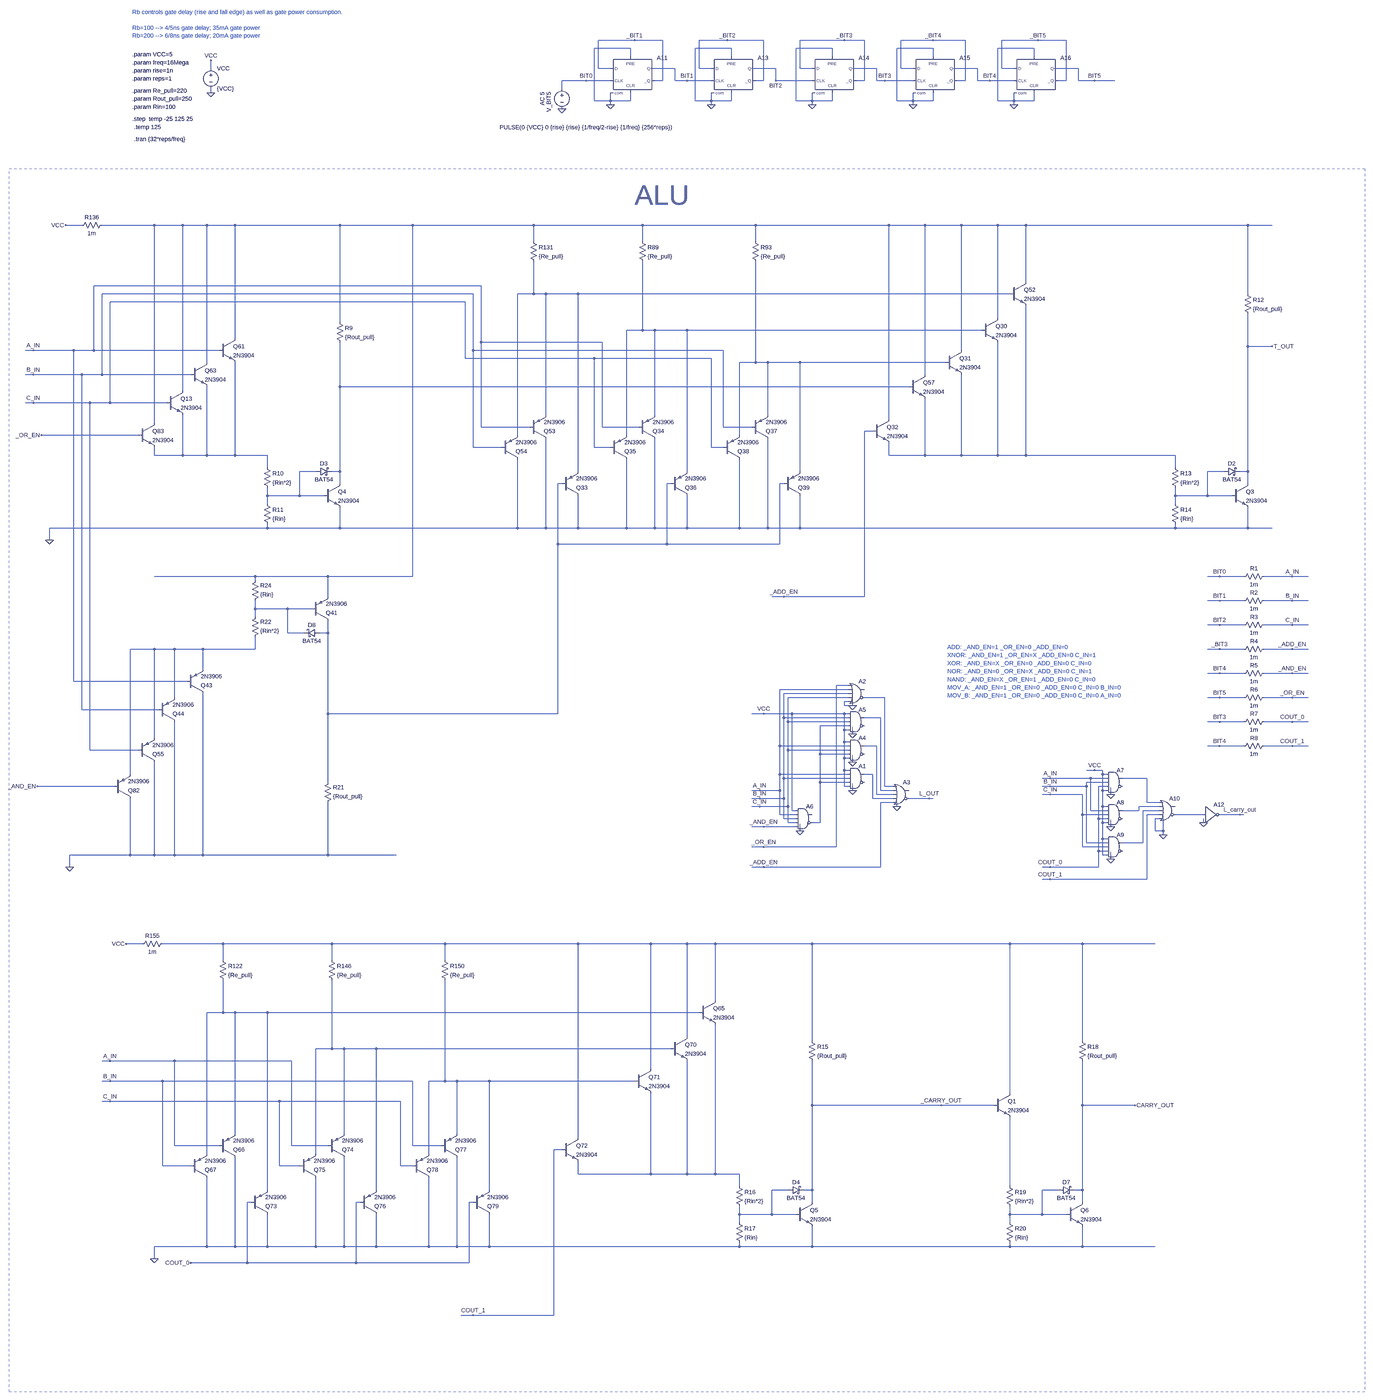
[diagram p0: schematic alu.asc, whole sheet]
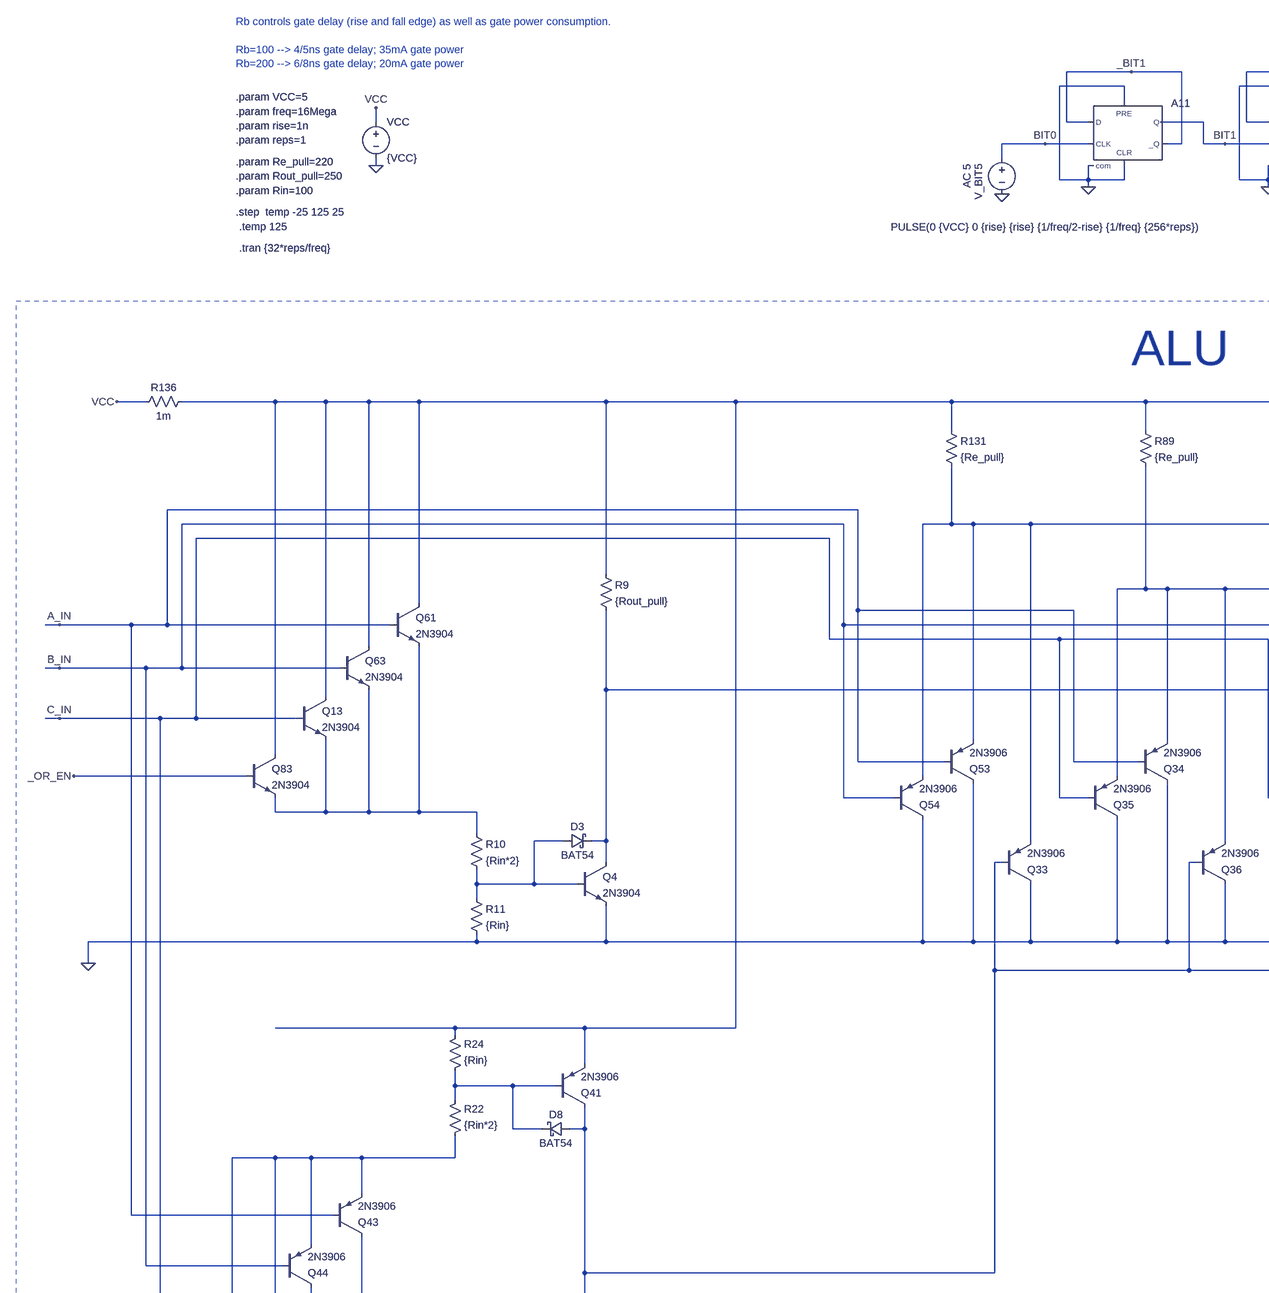
[diagram p1: schematic alu.asc, part, row 1 of 2, column 1 of 2]
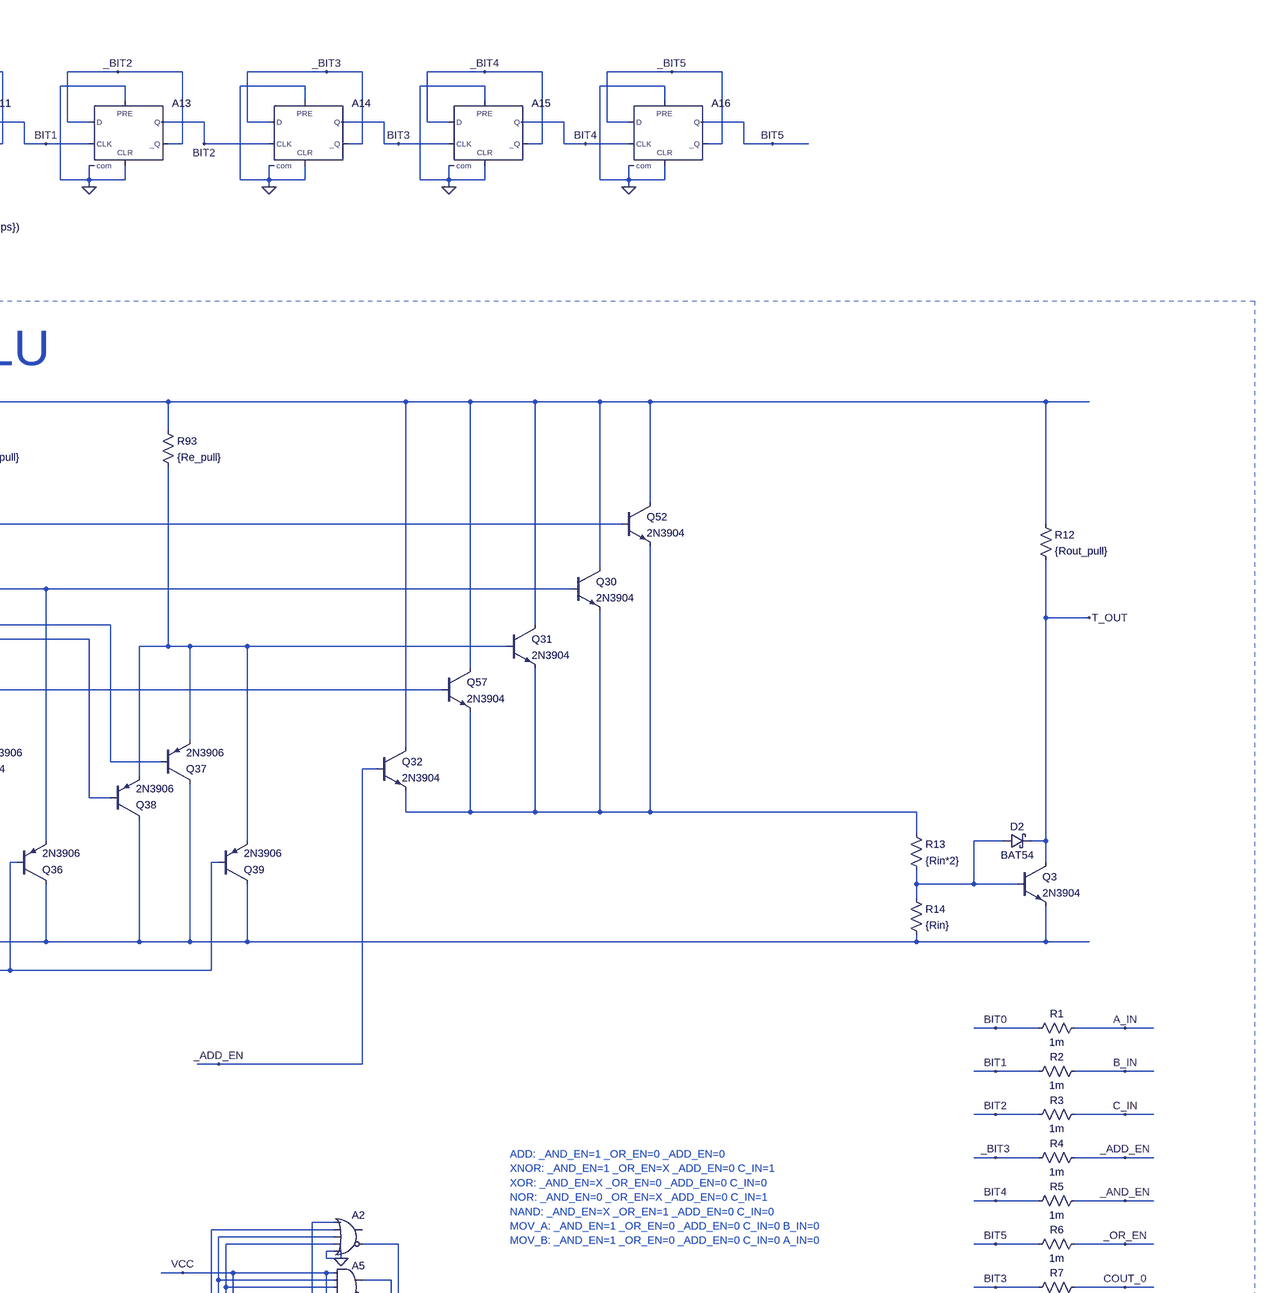
[diagram p2: schematic alu.asc, part, row 1 of 2, column 2 of 2]
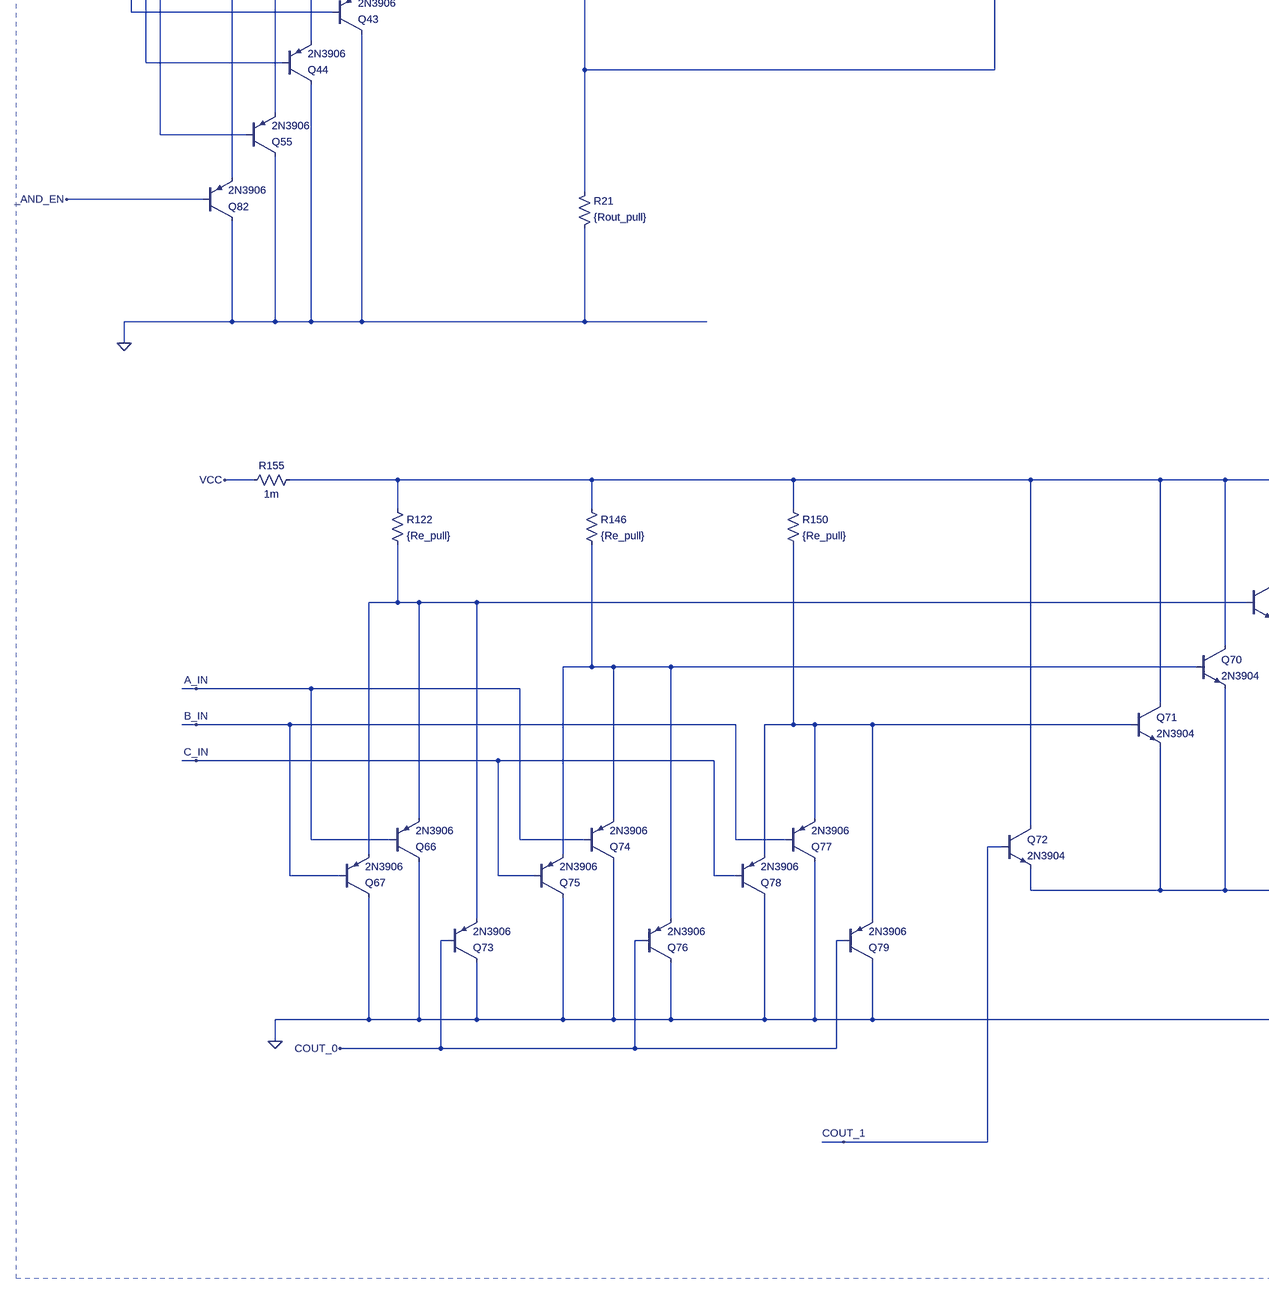
[diagram p3: schematic alu.asc, part, row 2 of 2, column 1 of 2]
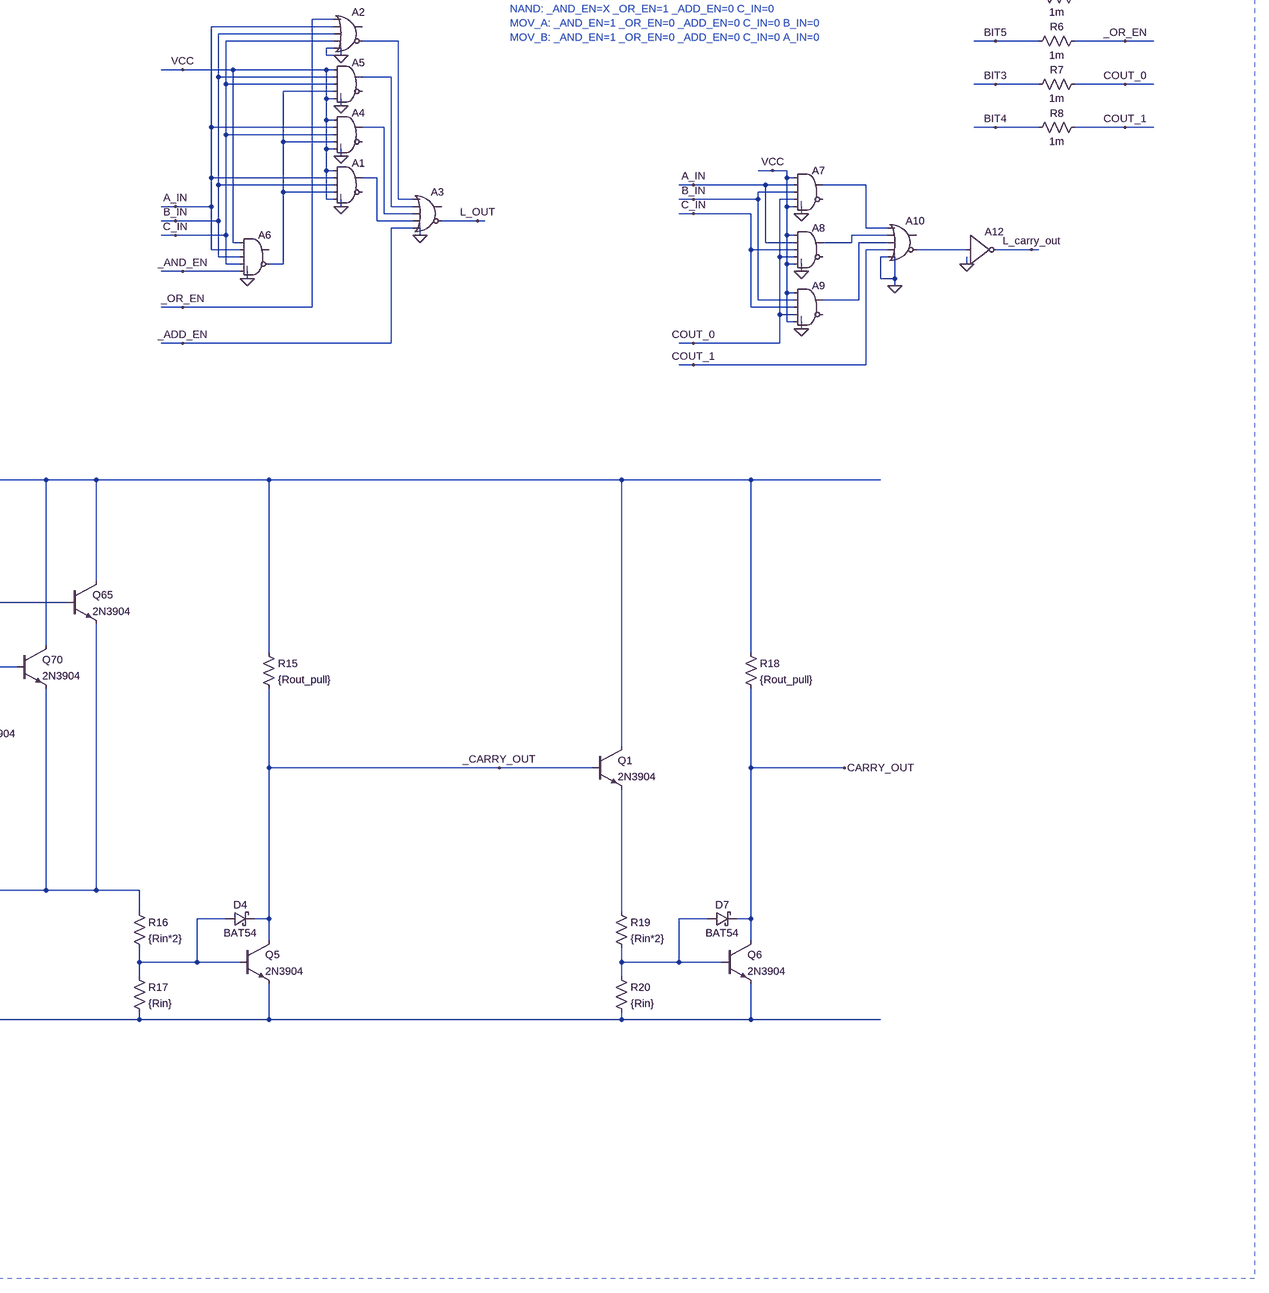
[diagram p4: schematic alu.asc, part, row 2 of 2, column 2 of 2]
alu.asc, the LTspice schematic file:
Version 4
SHEET 1 13860 8516
WIRE 5664 3040 5520 3040
WIRE 5776 3040 5664 3040
WIRE 6032 3040 5920 3040
WIRE 6176 3040 6032 3040
WIRE 6496 3040 6320 3040
WIRE 6576 3040 6496 3040
WIRE 6848 3040 6720 3040
WIRE 6976 3040 6848 3040
WIRE 7264 3040 7120 3040
WIRE 7376 3040 7264 3040
WIRE 5648 3072 5504 3072
WIRE 6048 3072 5904 3072
WIRE 6448 3072 6304 3072
WIRE 6848 3072 6704 3072
WIRE 7248 3072 7104 3072
WIRE 5648 3104 5648 3072
WIRE 6048 3104 6048 3072
WIRE 6448 3104 6448 3072
WIRE 6848 3104 6848 3072
WIRE 7248 3104 7248 3072
WIRE 3984 3152 3984 3120
WIRE 5520 3152 5520 3040
WIRE 5568 3152 5520 3152
WIRE 5824 3152 5728 3152
WIRE 5920 3152 5920 3040
WIRE 5968 3152 5920 3152
WIRE 6224 3152 6128 3152
WIRE 6320 3152 6320 3040
WIRE 6368 3152 6320 3152
WIRE 6624 3152 6528 3152
WIRE 6720 3152 6720 3040
WIRE 6768 3152 6720 3152
WIRE 7024 3152 6928 3152
WIRE 7120 3152 7120 3040
WIRE 7168 3152 7120 3152
WIRE 7424 3152 7328 3152
WIRE 5472 3200 5376 3200
WIRE 5568 3200 5472 3200
WIRE 5776 3200 5776 3040
WIRE 5776 3200 5744 3200
WIRE 5824 3200 5824 3152
WIRE 5872 3200 5824 3200
WIRE 5968 3200 5872 3200
WIRE 6176 3200 6176 3040
WIRE 6176 3200 6144 3200
WIRE 6224 3200 6224 3152
WIRE 6368 3200 6224 3200
WIRE 6576 3200 6576 3040
WIRE 6576 3200 6544 3200
WIRE 6624 3200 6624 3152
WIRE 6656 3200 6624 3200
WIRE 6768 3200 6656 3200
WIRE 6976 3200 6976 3040
WIRE 6976 3200 6944 3200
WIRE 7024 3200 7024 3152
WIRE 7072 3200 7024 3200
WIRE 7168 3200 7072 3200
WIRE 7376 3200 7376 3040
WIRE 7376 3200 7344 3200
WIRE 7424 3200 7424 3152
WIRE 7488 3200 7424 3200
WIRE 7568 3200 7488 3200
WIRE 5376 3232 5376 3200
WIRE 3984 3248 3984 3232
WIRE 5504 3280 5504 3072
WIRE 5568 3280 5568 3248
WIRE 5568 3280 5504 3280
WIRE 5648 3280 5648 3248
WIRE 5648 3280 5568 3280
WIRE 5904 3280 5904 3072
WIRE 5968 3280 5968 3248
WIRE 5968 3280 5904 3280
WIRE 6048 3280 6048 3248
WIRE 6048 3280 5968 3280
WIRE 6304 3280 6304 3072
WIRE 6368 3280 6368 3248
WIRE 6368 3280 6304 3280
WIRE 6448 3280 6448 3248
WIRE 6448 3280 6368 3280
WIRE 6704 3280 6704 3072
WIRE 6768 3280 6768 3248
WIRE 6768 3280 6704 3280
WIRE 6848 3280 6848 3248
WIRE 6848 3280 6768 3280
WIRE 7104 3280 7104 3072
WIRE 7168 3280 7168 3248
WIRE 7168 3280 7104 3280
WIRE 7248 3280 7248 3248
WIRE 7248 3280 7168 3280
WIRE 5568 3296 5568 3280
WIRE 5968 3296 5968 3280
WIRE 6368 3296 6368 3280
WIRE 6768 3296 6768 3280
WIRE 7168 3296 7168 3280
WIRE 3472 3888 3408 3888
WIRE 3760 3888 3552 3888
WIRE 3872 3888 3760 3888
WIRE 3968 3888 3872 3888
WIRE 4080 3888 3968 3888
WIRE 4496 3888 4080 3888
WIRE 4784 3888 4496 3888
WIRE 5264 3888 4784 3888
WIRE 5696 3888 5264 3888
WIRE 6144 3888 5696 3888
WIRE 6672 3888 6144 3888
WIRE 6816 3888 6672 3888
WIRE 6960 3888 6816 3888
WIRE 7104 3888 6960 3888
WIRE 7216 3888 7104 3888
WIRE 8096 3888 7216 3888
WIRE 8192 3888 8096 3888
WIRE 5264 3952 5264 3888
WIRE 5696 3952 5696 3888
WIRE 6144 3952 6144 3888
WIRE 7216 4112 7216 3888
WIRE 5056 4128 3520 4128
WIRE 5024 4160 3552 4160
WIRE 5264 4160 5264 4032
WIRE 5264 4160 5200 4160
WIRE 5312 4160 5264 4160
WIRE 5440 4160 5312 4160
WIRE 7152 4160 5440 4160
WIRE 8096 4160 8096 3888
WIRE 4992 4192 3584 4192
WIRE 7104 4256 7104 3888
WIRE 4496 4272 4496 3888
WIRE 5696 4304 5696 4032
WIRE 5696 4304 5632 4304
WIRE 5744 4304 5696 4304
WIRE 5872 4304 5744 4304
WIRE 7040 4304 5872 4304
WIRE 4080 4336 4080 3888
WIRE 5056 4352 5056 4128
WIRE 5536 4352 5056 4352
WIRE 8096 4368 8096 4240
WIRE 8192 4368 8096 4368
WIRE 3280 4384 3248 4384
WIRE 3440 4384 3280 4384
WIRE 3520 4384 3520 4128
WIRE 3520 4384 3440 4384
WIRE 4016 4384 3520 4384
WIRE 5024 4384 5024 4160
WIRE 6016 4384 5024 4384
WIRE 6960 4384 6960 3888
WIRE 4992 4416 4992 4192
WIRE 5504 4416 4992 4416
WIRE 5968 4416 5504 4416
WIRE 3968 4432 3968 3888
WIRE 6144 4432 6144 4032
WIRE 6144 4432 6080 4432
WIRE 6192 4432 6144 4432
WIRE 6320 4432 6192 4432
WIRE 6896 4432 6320 4432
WIRE 3280 4480 3248 4480
WIRE 3472 4480 3280 4480
WIRE 3552 4480 3552 4160
WIRE 3552 4480 3472 4480
WIRE 3904 4480 3552 4480
WIRE 6816 4480 6816 3888
WIRE 4496 4528 4496 4352
WIRE 6752 4528 4496 4528
WIRE 3872 4544 3872 3888
WIRE 3280 4592 3248 4592
WIRE 3504 4592 3280 4592
WIRE 3584 4592 3584 4192
WIRE 3584 4592 3504 4592
WIRE 3808 4592 3584 4592
WIRE 5312 4640 5312 4160
WIRE 5744 4640 5744 4304
WIRE 6192 4640 6192 4432
WIRE 6672 4656 6672 3888
WIRE 3760 4672 3760 3888
WIRE 5056 4688 5056 4352
WIRE 5248 4688 5056 4688
WIRE 5536 4688 5536 4352
WIRE 5680 4688 5536 4688
WIRE 6016 4688 6016 4384
WIRE 6128 4688 6016 4688
WIRE 6608 4704 6576 4704
WIRE 3696 4720 3312 4720
WIRE 5200 4720 5200 4160
WIRE 5632 4720 5632 4304
WIRE 6080 4720 6080 4432
WIRE 5024 4768 5024 4384
WIRE 5136 4768 5024 4768
WIRE 5504 4768 5504 4416
WIRE 5568 4768 5504 4768
WIRE 5968 4768 5968 4416
WIRE 6016 4768 5968 4768
WIRE 3760 4800 3760 4768
WIRE 3872 4800 3872 4640
WIRE 3872 4800 3760 4800
WIRE 3968 4800 3968 4528
WIRE 3968 4800 3872 4800
WIRE 4080 4800 4080 4432
WIRE 4080 4800 3968 4800
WIRE 4208 4800 4080 4800
WIRE 6672 4800 6672 4752
WIRE 6816 4800 6816 4576
WIRE 6816 4800 6672 4800
WIRE 6960 4800 6960 4480
WIRE 6960 4800 6816 4800
WIRE 7104 4800 7104 4352
WIRE 7104 4800 6960 4800
WIRE 7216 4800 7216 4208
WIRE 7216 4800 7104 4800
WIRE 7808 4800 7216 4800
WIRE 4208 4848 4208 4800
WIRE 7808 4848 7808 4800
WIRE 4400 4864 4336 4864
WIRE 4496 4864 4496 4528
WIRE 4496 4864 4464 4864
WIRE 5440 4864 5440 4160
WIRE 5872 4864 5872 4304
WIRE 6320 4864 6320 4432
WIRE 8000 4864 7936 4864
WIRE 8096 4864 8096 4368
WIRE 8096 4864 8064 4864
WIRE 4496 4912 4496 4864
WIRE 5376 4912 5360 4912
WIRE 5808 4912 5792 4912
WIRE 6256 4912 6240 4912
WIRE 8096 4912 8096 4864
WIRE 4208 4960 4208 4928
WIRE 4336 4960 4336 4864
WIRE 4336 4960 4208 4960
WIRE 4432 4960 4336 4960
WIRE 7808 4960 7808 4928
WIRE 7936 4960 7936 4864
WIRE 7936 4960 7808 4960
WIRE 8032 4960 7936 4960
WIRE 4208 4992 4208 4960
WIRE 7808 4992 7808 4960
WIRE 4208 5088 4208 5072
WIRE 4208 5088 3344 5088
WIRE 4496 5088 4496 5008
WIRE 4496 5088 4208 5088
WIRE 5200 5088 5200 4816
WIRE 5200 5088 4496 5088
WIRE 5312 5088 5312 4736
WIRE 5312 5088 5200 5088
WIRE 5440 5088 5440 4960
WIRE 5440 5088 5312 5088
WIRE 5632 5088 5632 4816
WIRE 5632 5088 5440 5088
WIRE 5744 5088 5744 4736
WIRE 5744 5088 5632 5088
WIRE 5872 5088 5872 4960
WIRE 5872 5088 5744 5088
WIRE 6080 5088 6080 4816
WIRE 6080 5088 5872 5088
WIRE 6192 5088 6192 4736
WIRE 6192 5088 6080 5088
WIRE 6320 5088 6320 4960
WIRE 6320 5088 6192 5088
WIRE 7808 5088 7808 5072
WIRE 7808 5088 6320 5088
WIRE 8096 5088 8096 5008
WIRE 8096 5088 7808 5088
WIRE 8192 5088 8096 5088
WIRE 3344 5136 3344 5088
WIRE 5360 5152 5360 4912
WIRE 5792 5152 5792 4912
WIRE 5792 5152 5360 5152
WIRE 6240 5152 6240 4912
WIRE 6240 5152 5792 5152
WIRE 4160 5280 3760 5280
WIRE 4448 5280 4160 5280
WIRE 4784 5280 4784 3888
WIRE 4784 5280 4448 5280
WIRE 7984 5280 7936 5280
WIRE 8080 5280 7984 5280
WIRE 8272 5280 8160 5280
WIRE 8336 5280 8272 5280
WIRE 4160 5296 4160 5280
WIRE 4448 5360 4448 5280
WIRE 6256 5360 6208 5360
WIRE 6576 5360 6576 4704
WIRE 6576 5360 6256 5360
WIRE 7984 5376 7936 5376
WIRE 8080 5376 7984 5376
WIRE 8272 5376 8160 5376
WIRE 8336 5376 8272 5376
WIRE 4160 5408 4160 5376
WIRE 4288 5408 4160 5408
WIRE 4384 5408 4288 5408
WIRE 4160 5440 4160 5408
WIRE 7984 5472 7936 5472
WIRE 8080 5472 7984 5472
WIRE 8272 5472 8160 5472
WIRE 8336 5472 8272 5472
WIRE 4288 5504 4288 5408
WIRE 4352 5504 4288 5504
WIRE 4448 5504 4448 5456
WIRE 4448 5504 4416 5504
WIRE 3760 5568 3664 5568
WIRE 3840 5568 3760 5568
WIRE 3952 5568 3840 5568
WIRE 4160 5568 4160 5520
WIRE 4160 5568 3952 5568
WIRE 7984 5568 7936 5568
WIRE 8080 5568 7984 5568
WIRE 8272 5568 8160 5568
WIRE 8336 5568 8272 5568
WIRE 3952 5648 3952 5568
WIRE 7984 5664 7936 5664
WIRE 8080 5664 7984 5664
WIRE 8272 5664 8160 5664
WIRE 8336 5664 8272 5664
WIRE 3440 5696 3440 4384
WIRE 3888 5696 3440 5696
WIRE 6512 5712 6464 5712
WIRE 6512 5728 6240 5728
WIRE 6512 5744 6256 5744
WIRE 3840 5760 3840 5568
WIRE 6512 5760 6272 5760
WIRE 6656 5760 6576 5760
WIRE 7984 5760 7936 5760
WIRE 8080 5760 7984 5760
WIRE 8272 5760 8160 5760
WIRE 8336 5760 8272 5760
WIRE 6512 5776 6496 5776
WIRE 6496 5792 6496 5776
WIRE 6528 5792 6528 5776
WIRE 6528 5792 6496 5792
WIRE 3472 5808 3472 4480
WIRE 3776 5808 3472 5808
WIRE 4448 5824 4448 5504
WIRE 5360 5824 5360 5152
WIRE 5360 5824 4448 5824
WIRE 6176 5824 6128 5824
WIRE 6288 5824 6176 5824
WIRE 6496 5824 6288 5824
WIRE 6512 5824 6496 5824
WIRE 6256 5840 6256 5744
WIRE 6512 5840 6256 5840
WIRE 6640 5840 6576 5840
WIRE 6272 5856 6272 5760
WIRE 6512 5856 6272 5856
WIRE 7984 5856 7936 5856
WIRE 8080 5856 7984 5856
WIRE 8272 5856 8160 5856
WIRE 8336 5856 8272 5856
WIRE 6512 5872 6400 5872
WIRE 6496 5888 6496 5824
WIRE 6512 5888 6496 5888
WIRE 6528 5904 6528 5888
WIRE 3760 5920 3760 5568
WIRE 6496 5936 6496 5888
WIRE 6512 5936 6496 5936
WIRE 6240 5952 6240 5728
WIRE 6512 5952 6240 5952
WIRE 6624 5952 6576 5952
WIRE 7984 5952 7936 5952
WIRE 8080 5952 7984 5952
WIRE 8272 5952 8160 5952
WIRE 8336 5952 8272 5952
WIRE 3504 5968 3504 4592
WIRE 3696 5968 3504 5968
WIRE 6272 5968 6272 5856
WIRE 6512 5968 6272 5968
WIRE 6400 5984 6400 5872
WIRE 6512 5984 6400 5984
WIRE 6496 6000 6496 5936
WIRE 6512 6000 6496 6000
WIRE 6528 6016 6528 6000
WIRE 6496 6048 6496 6000
WIRE 6512 6048 6496 6048
WIRE 7488 6048 7456 6048
WIRE 7520 6048 7488 6048
WIRE 3664 6064 3664 5568
WIRE 6240 6064 6240 5952
WIRE 6512 6064 6240 6064
WIRE 6608 6064 6576 6064
WIRE 7520 6064 7520 6048
WIRE 7536 6064 7520 6064
WIRE 6256 6080 6256 5840
WIRE 6512 6080 6256 6080
WIRE 7312 6080 7280 6080
WIRE 7472 6080 7312 6080
WIRE 7536 6080 7472 6080
WIRE 7696 6080 7600 6080
WIRE 4448 6096 4448 5824
WIRE 6400 6096 6400 5984
WIRE 6512 6096 6400 6096
WIRE 7536 6096 7456 6096
WIRE 3600 6112 3296 6112
WIRE 6496 6112 6496 6048
WIRE 6512 6112 6496 6112
WIRE 6656 6112 6656 5760
WIRE 6688 6112 6656 6112
WIRE 7312 6112 7280 6112
WIRE 7456 6112 7456 6096
WIRE 7456 6112 7312 6112
WIRE 7536 6112 7504 6112
WIRE 6160 6128 6128 6128
WIRE 6240 6128 6240 6064
WIRE 6240 6128 6160 6128
WIRE 6528 6128 6528 6112
WIRE 6640 6128 6640 5840
WIRE 6688 6128 6640 6128
WIRE 7520 6128 7520 6064
WIRE 7536 6128 7520 6128
WIRE 6624 6144 6624 5952
WIRE 6688 6144 6624 6144
WIRE 7312 6144 7280 6144
WIRE 7440 6144 7312 6144
WIRE 7552 6144 7552 6128
WIRE 6160 6160 6128 6160
WIRE 6256 6160 6256 6080
WIRE 6256 6160 6160 6160
WIRE 6608 6160 6608 6064
WIRE 6688 6160 6608 6160
WIRE 6832 6160 6752 6160
WIRE 6848 6160 6832 6160
WIRE 6688 6176 6640 6176
WIRE 7696 6176 7696 6080
WIRE 7744 6176 7696 6176
WIRE 6160 6192 6128 6192
WIRE 6272 6192 6272 5968
WIRE 6272 6192 6160 6192
WIRE 6704 6192 6704 6176
WIRE 7520 6192 7520 6128
WIRE 7536 6192 7520 6192
WIRE 7744 6192 7664 6192
WIRE 6288 6208 6288 5824
WIRE 6304 6208 6288 6208
WIRE 7472 6208 7472 6080
WIRE 7536 6208 7472 6208
WIRE 7664 6208 7664 6192
WIRE 7664 6208 7600 6208
WIRE 7744 6208 7680 6208
WIRE 6240 6224 6240 6128
WIRE 6304 6224 6240 6224
WIRE 7440 6224 7440 6144
WIRE 7536 6224 7440 6224
WIRE 7744 6224 7696 6224
WIRE 7920 6224 7808 6224
WIRE 8064 6224 7984 6224
WIRE 8080 6224 8064 6224
WIRE 6256 6240 6256 6160
WIRE 6304 6240 6256 6240
WIRE 7504 6240 7504 6112
WIRE 7536 6240 7504 6240
WIRE 7744 6240 7728 6240
WIRE 6272 6256 6272 6192
WIRE 6304 6256 6272 6256
WIRE 6400 6256 6400 6096
WIRE 6400 6256 6368 6256
WIRE 7520 6256 7520 6192
WIRE 7536 6256 7520 6256
WIRE 7920 6256 7920 6240
WIRE 6176 6272 6128 6272
WIRE 6304 6272 6176 6272
WIRE 7552 6272 7552 6256
WIRE 6320 6288 6320 6272
WIRE 7728 6288 7728 6240
WIRE 7760 6288 7760 6240
WIRE 7760 6288 7728 6288
WIRE 7760 6304 7760 6288
WIRE 7520 6320 7520 6256
WIRE 7536 6320 7520 6320
WIRE 7456 6336 7456 6112
WIRE 7536 6336 7456 6336
WIRE 7680 6336 7680 6208
WIRE 7680 6336 7600 6336
WIRE 6176 6352 6128 6352
WIRE 6464 6352 6464 5712
WIRE 6464 6352 6176 6352
WIRE 7440 6352 7440 6224
WIRE 7536 6352 7440 6352
WIRE 7504 6368 7504 6240
WIRE 7536 6368 7504 6368
WIRE 3664 6384 3664 6160
WIRE 3664 6384 3424 6384
WIRE 3760 6384 3760 6016
WIRE 3760 6384 3664 6384
WIRE 3840 6384 3840 5856
WIRE 3840 6384 3760 6384
WIRE 3952 6384 3952 5744
WIRE 3952 6384 3840 6384
WIRE 4448 6384 4448 6176
WIRE 4448 6384 3952 6384
WIRE 4720 6384 4448 6384
WIRE 7520 6384 7520 6320
WIRE 7536 6384 7520 6384
WIRE 7552 6400 7552 6384
WIRE 3424 6432 3424 6384
WIRE 6176 6432 6128 6432
WIRE 6640 6432 6640 6176
WIRE 6640 6432 6176 6432
WIRE 7312 6432 7280 6432
WIRE 7504 6432 7504 6368
WIRE 7504 6432 7312 6432
WIRE 7312 6480 7280 6480
WIRE 7696 6480 7696 6224
WIRE 7696 6480 7312 6480
WIRE 3712 6736 3648 6736
WIRE 4032 6736 3792 6736
WIRE 4464 6736 4032 6736
WIRE 4912 6736 4464 6736
WIRE 5440 6736 4912 6736
WIRE 5728 6736 5440 6736
WIRE 5872 6736 5728 6736
WIRE 5984 6736 5872 6736
WIRE 6368 6736 5984 6736
WIRE 7152 6736 6368 6736
WIRE 7440 6736 7152 6736
WIRE 7728 6736 7440 6736
WIRE 4032 6800 4032 6736
WIRE 4464 6800 4464 6736
WIRE 4912 6800 4912 6736
WIRE 5984 6960 5984 6736
WIRE 4032 7008 4032 6880
WIRE 4032 7008 3968 7008
WIRE 4080 7008 4032 7008
WIRE 4208 7008 4080 7008
WIRE 5920 7008 4208 7008
WIRE 5872 7104 5872 6736
WIRE 6368 7120 6368 6736
WIRE 7440 7120 7440 6736
WIRE 4464 7152 4464 6880
WIRE 4464 7152 4400 7152
WIRE 4512 7152 4464 7152
WIRE 4640 7152 4512 7152
WIRE 5808 7152 4640 7152
WIRE 3584 7200 3552 7200
WIRE 3840 7200 3584 7200
WIRE 4304 7200 3840 7200
WIRE 5728 7232 5728 6736
WIRE 3584 7280 3552 7280
WIRE 3792 7280 3584 7280
WIRE 4784 7280 3792 7280
WIRE 4912 7280 4912 6880
WIRE 4912 7280 4848 7280
WIRE 4960 7280 4912 7280
WIRE 5088 7280 4960 7280
WIRE 5664 7280 5088 7280
WIRE 7152 7328 7152 6736
WIRE 3584 7360 3552 7360
WIRE 4256 7360 3584 7360
WIRE 4736 7360 4256 7360
WIRE 6368 7376 6368 7200
WIRE 6880 7376 6368 7376
WIRE 7088 7376 6880 7376
WIRE 7440 7376 7440 7200
WIRE 7648 7376 7440 7376
WIRE 4080 7488 4080 7008
WIRE 4512 7488 4512 7152
WIRE 4960 7488 4960 7280
WIRE 5440 7504 5440 6736
WIRE 3840 7536 3840 7200
WIRE 4016 7536 3840 7536
WIRE 4304 7536 4304 7200
WIRE 4448 7536 4304 7536
WIRE 4784 7536 4784 7280
WIRE 4896 7536 4784 7536
WIRE 5376 7552 5344 7552
WIRE 3968 7568 3968 7008
WIRE 4400 7568 4400 7152
WIRE 4848 7568 4848 7280
WIRE 3792 7616 3792 7280
WIRE 3904 7616 3792 7616
WIRE 4256 7616 4256 7360
WIRE 4336 7616 4256 7616
WIRE 4736 7616 4736 7360
WIRE 4784 7616 4736 7616
WIRE 5440 7648 5440 7600
WIRE 5728 7648 5728 7328
WIRE 5728 7648 5440 7648
WIRE 5872 7648 5872 7200
WIRE 5872 7648 5728 7648
WIRE 5984 7648 5984 7056
WIRE 5984 7648 5872 7648
WIRE 6080 7648 5984 7648
WIRE 6080 7696 6080 7648
WIRE 7152 7696 7152 7424
WIRE 4208 7712 4208 7008
WIRE 4640 7712 4640 7152
WIRE 5088 7712 5088 7280
WIRE 6272 7712 6208 7712
WIRE 6368 7712 6368 7376
WIRE 6368 7712 6336 7712
WIRE 7344 7712 7280 7712
WIRE 7440 7712 7440 7376
WIRE 7440 7712 7408 7712
WIRE 4144 7760 4128 7760
WIRE 4576 7760 4560 7760
WIRE 5024 7760 5008 7760
WIRE 6368 7760 6368 7712
WIRE 7440 7760 7440 7712
WIRE 6080 7808 6080 7776
WIRE 6208 7808 6208 7712
WIRE 6208 7808 6080 7808
WIRE 6304 7808 6208 7808
WIRE 7152 7808 7152 7776
WIRE 7280 7808 7280 7712
WIRE 7280 7808 7152 7808
WIRE 7376 7808 7280 7808
WIRE 6080 7840 6080 7808
WIRE 7152 7840 7152 7808
WIRE 3968 7936 3968 7664
WIRE 3968 7936 3760 7936
WIRE 4080 7936 4080 7584
WIRE 4080 7936 3968 7936
WIRE 4208 7936 4208 7808
WIRE 4208 7936 4080 7936
WIRE 4400 7936 4400 7664
WIRE 4400 7936 4208 7936
WIRE 4512 7936 4512 7584
WIRE 4512 7936 4400 7936
WIRE 4640 7936 4640 7808
WIRE 4640 7936 4512 7936
WIRE 4848 7936 4848 7664
WIRE 4848 7936 4640 7936
WIRE 4960 7936 4960 7584
WIRE 4960 7936 4848 7936
WIRE 5088 7936 5088 7808
WIRE 5088 7936 4960 7936
WIRE 6080 7936 6080 7920
WIRE 6080 7936 5088 7936
WIRE 6368 7936 6368 7856
WIRE 6368 7936 6080 7936
WIRE 7152 7936 7152 7920
WIRE 7152 7936 6368 7936
WIRE 7440 7936 7440 7856
WIRE 7440 7936 7152 7936
WIRE 7728 7936 7440 7936
WIRE 3760 7984 3760 7936
WIRE 4128 8000 4128 7760
WIRE 4128 8000 3904 8000
WIRE 4560 8000 4560 7760
WIRE 4560 8000 4128 8000
WIRE 5008 8000 5008 7760
WIRE 5008 8000 4560 8000
WIRE 5024 8208 4976 8208
WIRE 5344 8208 5344 7552
WIRE 5344 8208 5024 8208
FLAG 3984 3248 0
FLAG 3984 3120 VCC
FLAG 8192 4368 T_OUT
FLAG 3344 5136 0
FLAG 3280 4384 A_IN
FLAG 3408 3888 VCC
FLAG 3280 4480 B_IN
FLAG 3280 4592 C_IN
FLAG 6256 5360 _ADD_EN
FLAG 3424 6432 0
FLAG 6880 7376 _CARRY_OUT
FLAG 5024 8208 COUT_1
FLAG 3584 7200 A_IN
FLAG 3584 7280 B_IN
FLAG 3584 7360 C_IN
FLAG 3760 7984 0
FLAG 3648 6736 VCC
FLAG 3904 8000 COUT_0
FLAG 7648 7376 CARRY_OUT
FLAG 6528 6016 0
FLAG 6528 6128 0
FLAG 6704 6192 0
FLAG 6320 6288 0
FLAG 6528 5904 0
FLAG 6528 5792 0
FLAG 7552 6400 0
FLAG 7552 6272 0
FLAG 7760 6304 0
FLAG 7920 6256 0
FLAG 7552 6144 0
FLAG 7488 6048 VCC
FLAG 6176 5824 VCC
FLAG 5568 3296 0
FLAG 5376 3312 0
FLAG 5472 3200 BIT0
FLAG 5872 3200 BIT1
FLAG 5968 3296 0
FLAG 6224 3200 BIT2
FLAG 6368 3296 0
FLAG 6496 3040 _BIT3
FLAG 6768 3296 0
FLAG 7072 3200 BIT4
FLAG 7168 3296 0
FLAG 7488 3200 BIT5
FLAG 6160 6128 A_IN
FLAG 6160 6160 B_IN
FLAG 6160 6192 C_IN
FLAG 6176 6272 _AND_EN
FLAG 6176 6352 _OR_EN
FLAG 6176 6432 _ADD_EN
FLAG 6832 6160 L_OUT
FLAG 7312 6080 A_IN
FLAG 7312 6112 B_IN
FLAG 7312 6144 C_IN
FLAG 3296 6112 _AND_EN
FLAG 3312 4720 _OR_EN
FLAG 6656 3200 BIT3
FLAG 7312 6432 COUT_0
FLAG 7312 6480 COUT_1
FLAG 8064 6224 L_carry_out
FLAG 8272 5280 A_IN
FLAG 8272 5376 B_IN
FLAG 8272 5472 C_IN
FLAG 8272 5568 _ADD_EN
FLAG 8272 5664 _AND_EN
FLAG 8272 5760 _OR_EN
FLAG 8272 5856 COUT_0
FLAG 8272 5952 COUT_1
FLAG 5664 3040 _BIT1
FLAG 6032 3040 _BIT2
FLAG 6848 3040 _BIT4
FLAG 7264 3040 _BIT5
FLAG 7984 5280 BIT0
FLAG 7984 5376 BIT1
FLAG 7984 5472 BIT2
FLAG 7984 5568 _BIT3
FLAG 7984 5664 BIT4
FLAG 7984 5760 BIT5
FLAG 7984 5856 BIT3
FLAG 7984 5952 BIT4
SYMBOL voltage 3984 3136 R0
WINDOW 123 0 0 Left 0
WINDOW 39 0 0 Left 0
SYMATTR InstName VCC
SYMATTR Value {VCC}
SYMBOL npn 7152 4112 R0
SYMATTR InstName Q52
SYMATTR Value 2N3904
SYMBOL pnp 5248 4736 M180
SYMATTR InstName Q53
SYMATTR Value 2N3906
SYMBOL pnp 5136 4816 M180
SYMATTR InstName Q54
SYMATTR Value 2N3906
SYMBOL npn 6752 4480 R0
SYMATTR InstName Q57
SYMATTR Value 2N3904
SYMBOL res 5248 3936 R0
SYMATTR InstName R131
SYMATTR Value {Re_pull}
SYMBOL res 3456 3904 R270
WINDOW 0 32 56 VTop 2
WINDOW 3 0 56 VBottom 2
SYMATTR InstName R136
SYMATTR Value 1m
SYMBOL npn 4016 4336 R0
SYMATTR InstName Q61
SYMATTR Value 2N3904
SYMBOL npn 3904 4432 R0
SYMATTR InstName Q63
SYMATTR Value 2N3904
SYMBOL npn 3808 4544 R0
SYMATTR InstName Q13
SYMATTR Value 2N3904
SYMBOL npn 7040 4256 R0
SYMATTR InstName Q30
SYMATTR Value 2N3904
SYMBOL npn 6896 4384 R0
SYMATTR InstName Q31
SYMATTR Value 2N3904
SYMBOL npn 6608 4656 R0
SYMATTR InstName Q32
SYMATTR Value 2N3904
SYMBOL pnp 5376 4960 M180
SYMATTR InstName Q33
SYMATTR Value 2N3906
SYMBOL pnp 5680 4736 M180
SYMATTR InstName Q34
SYMATTR Value 2N3906
SYMBOL pnp 5568 4816 M180
SYMATTR InstName Q35
SYMATTR Value 2N3906
SYMBOL res 5680 3936 R0
SYMATTR InstName R89
SYMATTR Value {Re_pull}
SYMBOL pnp 5808 4960 M180
SYMATTR InstName Q36
SYMATTR Value 2N3906
SYMBOL pnp 6128 4736 M180
SYMATTR InstName Q37
SYMATTR Value 2N3906
SYMBOL pnp 6016 4816 M180
SYMATTR InstName Q38
SYMATTR Value 2N3906
SYMBOL res 6128 3936 R0
SYMATTR InstName R93
SYMATTR Value {Re_pull}
SYMBOL pnp 6256 4960 M180
SYMATTR InstName Q39
SYMATTR Value 2N3906
SYMBOL pnp 4384 5456 M180
SYMATTR InstName Q41
SYMATTR Value 2N3906
SYMBOL pnp 3888 5744 M180
SYMATTR InstName Q43
SYMATTR Value 2N3906
SYMBOL pnp 3776 5856 M180
SYMATTR InstName Q44
SYMATTR Value 2N3906
SYMBOL pnp 3696 6016 M180
SYMATTR InstName Q55
SYMATTR Value 2N3906
SYMBOL npn 5920 6960 R0
SYMATTR InstName Q65
SYMATTR Value 2N3904
SYMBOL pnp 4016 7584 M180
SYMATTR InstName Q66
SYMATTR Value 2N3906
SYMBOL pnp 3904 7664 M180
SYMATTR InstName Q67
SYMATTR Value 2N3906
SYMBOL res 4016 6784 R0
SYMATTR InstName R122
SYMATTR Value {Re_pull}
SYMBOL npn 5808 7104 R0
SYMATTR InstName Q70
SYMATTR Value 2N3904
SYMBOL npn 5664 7232 R0
SYMATTR InstName Q71
SYMATTR Value 2N3904
SYMBOL npn 5376 7504 R0
SYMATTR InstName Q72
SYMATTR Value 2N3904
SYMBOL pnp 4144 7808 M180
SYMATTR InstName Q73
SYMATTR Value 2N3906
SYMBOL pnp 4448 7584 M180
SYMATTR InstName Q74
SYMATTR Value 2N3906
SYMBOL pnp 4336 7664 M180
SYMATTR InstName Q75
SYMATTR Value 2N3906
SYMBOL res 4448 6784 R0
SYMATTR InstName R146
SYMATTR Value {Re_pull}
SYMBOL pnp 4576 7808 M180
SYMATTR InstName Q76
SYMATTR Value 2N3906
SYMBOL pnp 4896 7584 M180
SYMATTR InstName Q77
SYMATTR Value 2N3906
SYMBOL pnp 4784 7664 M180
SYMATTR InstName Q78
SYMATTR Value 2N3906
SYMBOL res 4896 6784 R0
SYMATTR InstName R150
SYMATTR Value {Re_pull}
SYMBOL pnp 5024 7808 M180
SYMATTR InstName Q79
SYMATTR Value 2N3906
SYMBOL res 3696 6752 R270
WINDOW 0 32 56 VTop 2
WINDOW 3 0 56 VBottom 2
SYMATTR InstName R155
SYMATTR Value 1m
SYMBOL Digital\\and 6544 6016 R0
SYMATTR SpiceLine Vhigh={VCC}
SYMATTR InstName A1
SYMBOL Digital\\or 6720 6080 R0
SYMATTR SpiceLine Vhigh={VCC}
SYMATTR InstName A3
SYMBOL Digital\\and 6544 5904 R0
SYMATTR SpiceLine Vhigh={VCC}
SYMATTR InstName A4
SYMBOL Digital\\and 6544 5792 R0
SYMATTR SpiceLine Vhigh={VCC}
SYMATTR InstName A5
SYMBOL Digital\\or 6544 5680 R0
SYMATTR SpiceLine Vhigh={VCC}
SYMATTR InstName A2
SYMBOL Digital\\and 6336 6176 R0
SYMATTR SpiceLine Vhigh={VCC}
SYMATTR InstName A6
SYMBOL Digital\\and 7568 6032 R0
SYMATTR SpiceLine Vhigh={VCC}
SYMATTR InstName A7
SYMBOL Digital\\and 7568 6160 R0
SYMATTR SpiceLine Vhigh={VCC}
SYMATTR InstName A8
SYMBOL Digital\\and 7568 6288 R0
SYMATTR SpiceLine Vhigh={VCC}
SYMATTR InstName A9
SYMBOL Digital\\or 7776 6144 R0
SYMATTR SpiceLine Vhigh={VCC}
SYMATTR InstName A10
SYMBOL Digital\\inv 7920 6160 R0
SYMATTR SpiceLine Vhigh={VCC}
SYMATTR InstName A12
SYMBOL voltage 5376 3216 R0
WINDOW 123 -77 30 VRight 2
WINDOW 39 0 0 Left 0
WINDOW 0 -51 28 VRight 2
WINDOW 3 438 169 Right 2
SYMATTR Value2 AC 5
SYMATTR InstName V_BIT5
SYMATTR Value PULSE(0 {VCC} 0 {rise} {rise} {1/freq/2-rise} {1/freq} {256*reps})
SYMBOL Digital\\dflop 5648 3104 R0
SYMATTR SpiceLine Vhigh={VCC}
SYMATTR InstName A11
SYMBOL Digital\\dflop 6048 3104 R0
SYMATTR SpiceLine Vhigh={VCC}
SYMATTR InstName A13
SYMBOL Digital\\dflop 6848 3104 R0
SYMATTR SpiceLine Vhigh={VCC}
SYMATTR InstName A15
SYMBOL Digital\\dflop 7248 3104 R0
SYMATTR SpiceLine Vhigh={VCC}
SYMATTR InstName A16
SYMBOL Digital\\dflop 6448 3104 R0
SYMATTR SpiceLine Vhigh={VCC}
SYMATTR InstName A14
SYMBOL pnp 3600 6160 M180
SYMATTR InstName Q82
SYMATTR Value 2N3906
SYMBOL npn 3696 4672 R0
SYMATTR InstName Q83
SYMATTR Value 2N3904
SYMBOL npn 8032 4912 R0
SYMATTR InstName Q3
SYMATTR Value 2N3904
SYMBOL schottky 8000 4880 R270
WINDOW 0 32 32 VTop 2
WINDOW 3 0 32 VBottom 2
SYMATTR InstName D2
SYMATTR Value BAT54
SYMATTR Description Diode
SYMATTR Type diode
SYMBOL res 8080 4144 R0
SYMATTR InstName R12
SYMATTR Value {Rout_pull}
SYMBOL res 7792 4832 R0
SYMATTR InstName R13
SYMATTR Value {Rin*2}
SYMBOL res 7792 4976 R0
SYMATTR InstName R14
SYMATTR Value {Rin}
SYMBOL npn 4432 4912 R0
SYMATTR InstName Q4
SYMATTR Value 2N3904
SYMBOL schottky 4400 4880 R270
WINDOW 0 32 32 VTop 2
WINDOW 3 0 32 VBottom 2
SYMATTR InstName D3
SYMATTR Value BAT54
SYMATTR Description Diode
SYMATTR Type diode
SYMBOL res 4480 4256 R0
SYMATTR InstName R9
SYMATTR Value {Rout_pull}
SYMBOL res 4192 4832 R0
SYMATTR InstName R10
SYMATTR Value {Rin*2}
SYMBOL res 4192 4976 R0
SYMATTR InstName R11
SYMATTR Value {Rin}
SYMBOL npn 6304 7760 R0
SYMATTR InstName Q5
SYMATTR Value 2N3904
SYMBOL schottky 6272 7728 R270
WINDOW 0 32 32 VTop 2
WINDOW 3 0 32 VBottom 2
SYMATTR InstName D4
SYMATTR Value BAT54
SYMATTR Description Diode
SYMATTR Type diode
SYMBOL res 6352 7104 R0
SYMATTR InstName R15
SYMATTR Value {Rout_pull}
SYMBOL res 6064 7680 R0
SYMATTR InstName R16
SYMATTR Value {Rin*2}
SYMBOL res 6064 7824 R0
SYMATTR InstName R17
SYMATTR Value {Rin}
SYMBOL npn 7376 7760 R0
SYMATTR InstName Q6
SYMATTR Value 2N3904
SYMBOL schottky 7344 7728 R270
WINDOW 0 32 32 VTop 2
WINDOW 3 0 32 VBottom 2
SYMATTR InstName D7
SYMATTR Value BAT54
SYMATTR Description Diode
SYMATTR Type diode
SYMBOL res 7424 7104 R0
SYMATTR InstName R18
SYMATTR Value {Rout_pull}
SYMBOL res 7136 7680 R0
SYMATTR InstName R19
SYMATTR Value {Rin*2}
SYMBOL res 7136 7824 R0
SYMATTR InstName R20
SYMATTR Value {Rin}
SYMBOL schottky 4416 5520 M270
WINDOW 0 32 32 VTop 2
WINDOW 3 0 32 VBottom 2
SYMATTR InstName D8
SYMATTR Value BAT54
SYMATTR Description Diode
SYMATTR Type diode
SYMBOL res 4432 6192 M180
WINDOW 0 36 76 Left 2
WINDOW 3 36 40 Left 2
SYMATTR InstName R21
SYMATTR Value {Rout_pull}
SYMBOL res 4144 5536 M180
WINDOW 0 36 76 Left 2
WINDOW 3 36 40 Left 2
SYMATTR InstName R22
SYMATTR Value {Rin*2}
SYMBOL res 4144 5392 M180
WINDOW 0 36 76 Left 2
WINDOW 3 36 40 Left 2
SYMATTR InstName R24
SYMATTR Value {Rin}
SYMBOL res 8176 5264 R90
WINDOW 0 0 56 VBottom 2
WINDOW 3 32 56 VTop 2
SYMATTR InstName R1
SYMATTR Value 1m
SYMBOL res 8176 5360 R90
WINDOW 0 0 56 VBottom 2
WINDOW 3 32 56 VTop 2
SYMATTR InstName R2
SYMATTR Value 1m
SYMBOL res 8176 5456 R90
WINDOW 0 0 56 VBottom 2
WINDOW 3 32 56 VTop 2
SYMATTR InstName R3
SYMATTR Value 1m
SYMBOL res 8176 5552 R90
WINDOW 0 0 56 VBottom 2
WINDOW 3 32 56 VTop 2
SYMATTR InstName R4
SYMATTR Value 1m
SYMBOL res 8176 5648 R90
WINDOW 0 0 56 VBottom 2
WINDOW 3 32 56 VTop 2
SYMATTR InstName R5
SYMATTR Value 1m
SYMBOL res 8176 5744 R90
WINDOW 0 0 56 VBottom 2
WINDOW 3 32 56 VTop 2
SYMATTR InstName R6
SYMATTR Value 1m
SYMBOL res 8176 5840 R90
WINDOW 0 0 56 VBottom 2
WINDOW 3 32 56 VTop 2
SYMATTR InstName R7
SYMATTR Value 1m
SYMBOL res 8176 5936 R90
WINDOW 0 0 56 VBottom 2
WINDOW 3 32 56 VTop 2
SYMATTR InstName R8
SYMATTR Value 1m
SYMBOL npn 7088 7328 R0
SYMATTR InstName Q1
SYMATTR Value 2N3904
TEXT 3680 3432 Left 2 !.tran {32*reps/freq}
TEXT 3672 3096 Left 2 !.param VCC=5
TEXT 3672 3128 Left 2 !.param freq=16Mega
TEXT 3672 3160 Left 2 !.param rise=1n
TEXT 3672 3192 Left 2 !.param reps=1
TEXT 3672 3240 Left 2 !.param Re_pull=220
TEXT 3672 2928 Left 2 ;Rb controls gate delay (rise and fall edge) as well as gate power consumption.\n \nRb=100 --> 4/5ns gate delay; 35mA gate power\nRb=200 --> 6/8ns gate delay; 20mA gate power
TEXT 5664 3768 Left 7 ;ALU
TEXT 6904 5560 Left 2 ;ADD: _AND_EN=1 _OR_EN=0 _ADD_EN=0
TEXT 6904 5592 Left 2 ;XNOR: _AND_EN=1 _OR_EN=X _ADD_EN=0 C_IN=1
TEXT 6904 5624 Left 2 ;XOR: _AND_EN=X _OR_EN=0 _ADD_EN=0 C_IN=0
TEXT 6904 5656 Left 2 ;NOR: _AND_EN=0 _OR_EN=X _ADD_EN=0 C_IN=1
TEXT 6904 5688 Left 2 ;NAND: _AND_EN=X _OR_EN=1 _ADD_EN=0 C_IN=0
TEXT 6904 5720 Left 2 ;MOV_A: _AND_EN=1 _OR_EN=0 _ADD_EN=0 C_IN=0 B_IN=0
TEXT 6904 5752 Left 2 ;MOV_B: _AND_EN=1 _OR_EN=0 _ADD_EN=0 C_IN=0 A_IN=0
TEXT 3672 3272 Left 2 !.param Rout_pull=250
TEXT 3672 3304 Left 2 !.param Rin=100
TEXT 3672 3352 Left 2 !.step  temp -25 125 25
TEXT 3680 3384 Left 2 !.temp 125
RECTANGLE Normal 8560 8512 3184 3664 2

The netlist it stands for:
* alu.asc
VCC VCC 0 {VCC}
Q52 N001 N002 N007 0 2N3904
Q53 0 A_IN N002 0 2N3906
Q54 0 B_IN N002 0 2N3906
Q57 N001 N005 N007 0 2N3904
R131 N001 N002 {Re_pull}
R136 VCC N001 1m
Q61 N001 A_IN N006 0 2N3904
Q63 N001 B_IN N006 0 2N3904
Q13 N001 C_IN N006 0 2N3904
Q30 N001 N003 N007 0 2N3904
Q31 N001 N004 N007 0 2N3904
Q32 N001 _ADD_EN N007 0 2N3904
Q33 0 N010 N002 0 2N3906
Q34 0 A_IN N003 0 2N3906
Q35 0 C_IN N003 0 2N3906
R89 N001 N003 {Re_pull}
Q36 0 N010 N003 0 2N3906
Q37 0 B_IN N004 0 2N3906
Q38 0 C_IN N004 0 2N3906
R93 N001 N004 {Re_pull}
Q39 0 N010 N004 0 2N3906
Q41 N010 N011 N001 0 2N3906
Q43 0 A_IN N012 0 2N3906
Q44 0 B_IN N012 0 2N3906
Q55 0 C_IN N012 0 2N3906
Q65 N022 N023 N026 0 2N3904
Q66 0 A_IN N023 0 2N3906
Q67 0 B_IN N023 0 2N3906
R122 N022 N023 {Re_pull}
Q70 N022 N024 N026 0 2N3904
Q71 N022 N025 N026 0 2N3904
Q72 N022 COUT_1 N026 0 2N3904
Q73 0 COUT_0 N023 0 2N3906
Q74 0 A_IN N024 0 2N3906
Q75 0 C_IN N024 0 2N3906
R146 N022 N024 {Re_pull}
Q76 0 COUT_0 N024 0 2N3906
Q77 0 B_IN N025 0 2N3906
Q78 0 C_IN N025 0 2N3906
R150 N022 N025 {Re_pull}
Q79 0 COUT_0 N025 0 2N3906
R155 VCC N022 1m
A1 VCC A_IN B_IN N015 VCC 0 N017 0 AND Vhigh={VCC}
A3 N013 N014 N016 N017 _ADD_EN L_OUT 0 0 OR Vhigh={VCC}
A4 VCC A_IN C_IN N015 VCC 0 N016 0 AND Vhigh={VCC}
A5 VCC B_IN C_IN N015 VCC 0 N014 0 AND Vhigh={VCC}
A2 _OR_EN A_IN B_IN C_IN 0 N013 0 0 OR Vhigh={VCC}
A6 VCC A_IN B_IN C_IN _AND_EN N015 0 0 AND Vhigh={VCC}
A7 VCC A_IN B_IN COUT_0 VCC 0 N018 0 AND Vhigh={VCC}
A8 VCC A_IN C_IN COUT_0 VCC 0 N019 0 AND Vhigh={VCC}
A9 VCC B_IN C_IN COUT_0 VCC 0 N020 0 AND Vhigh={VCC}
A10 N018 N019 N020 COUT_1 0 N021 0 0 OR Vhigh={VCC}
A12 N021 0 0 0 0 L_carry_out 0 0 BUF Vhigh={VCC}
V_BIT5 BIT0 0 PULSE(0 {VCC} 0 {rise} {rise} {1/freq/2-rise} {1/freq} {256*reps}) AC 5
A11 _BIT1 0 BIT0 0 0 _BIT1 BIT1 0 DFLOP Vhigh={VCC}
A13 _BIT2 0 BIT1 0 0 _BIT2 BIT2 0 DFLOP Vhigh={VCC}
A15 _BIT4 0 BIT3 0 0 _BIT4 BIT4 0 DFLOP Vhigh={VCC}
A16 _BIT5 0 BIT4 0 0 _BIT5 BIT5 0 DFLOP Vhigh={VCC}
A14 _BIT3 0 BIT2 0 0 _BIT3 BIT3 0 DFLOP Vhigh={VCC}
Q82 0 _AND_EN N012 0 2N3906
Q83 N001 _OR_EN N006 0 2N3904
Q3 T_OUT N009 0 0 2N3904
D2 N009 T_OUT BAT54
R12 N001 T_OUT {Rout_pull}
R13 N007 N009 {Rin*2}
R14 N009 0 {Rin}
Q4 N005 N008 0 0 2N3904
D3 N008 N005 BAT54
R9 N001 N005 {Rout_pull}
R10 N006 N008 {Rin*2}
R11 N008 0 {Rin}
Q5 _CARRY_OUT N028 0 0 2N3904
D4 N028 _CARRY_OUT BAT54
R15 N022 _CARRY_OUT {Rout_pull}
R16 N026 N028 {Rin*2}
R17 N028 0 {Rin}
Q6 CARRY_OUT N029 0 0 2N3904
D7 N029 CARRY_OUT BAT54
R18 N022 CARRY_OUT {Rout_pull}
R19 N027 N029 {Rin*2}
R20 N029 0 {Rin}
D8 N010 N011 BAT54
R21 0 N010 {Rout_pull}
R22 N012 N011 {Rin*2}
R24 N011 N001 {Rin}
R1 A_IN BIT0 1m
R2 B_IN BIT1 1m
R3 C_IN BIT2 1m
R4 _ADD_EN _BIT3 1m
R5 _AND_EN BIT4 1m
R6 _OR_EN BIT5 1m
R7 COUT_0 BIT3 1m
R8 COUT_1 BIT4 1m
Q1 N022 _CARRY_OUT N027 0 2N3904
.model D D
.lib standard.dio
.model NPN NPN
.model PNP PNP
.lib standard.bjt
.tran {32*reps/freq}
.param VCC=5
.param freq=16Mega
.param rise=1n
.param reps=1
.param Re_pull=220
* Rb controls gate delay (rise and fall edge) as well as gate power consumption.
* Rb=100 --> 4/5ns gate delay; 35mA gate power
* Rb=200 --> 6/8ns gate delay; 20mA gate power
* ALU
* ADD: _AND_EN=1 _OR_EN=0 _ADD_EN=0
* XNOR: _AND_EN=1 _OR_EN=X _ADD_EN=0 C_IN=1
* XOR: _AND_EN=X _OR_EN=0 _ADD_EN=0 C_IN=0
* NOR: _AND_EN=0 _OR_EN=X _ADD_EN=0 C_IN=1
* NAND: _AND_EN=X _OR_EN=1 _ADD_EN=0 C_IN=0
* MOV_A: _AND_EN=1 _OR_EN=0 _ADD_EN=0 C_IN=0 B_IN=0
* MOV_B: _AND_EN=1 _OR_EN=0 _ADD_EN=0 C_IN=0 A_IN=0
.param Rout_pull=250
.param Rin=100
.step  temp -25 125 25
.temp 125
.backanno
.end